# EAGLE design led 4x6 board (EAGLE 9.0.0)
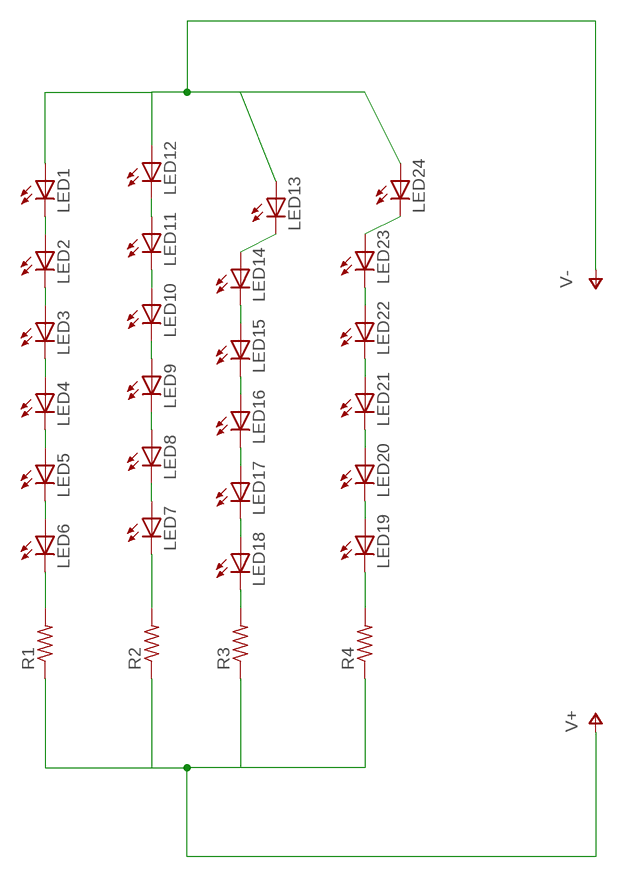
[diagram p0: schematic, sheet 1]

## Parts
LED1  LEDLZR181  [LZR181]
LED2  LEDLZR181  [LZR181]
LED3  LEDLZR181  [LZR181]
LED4  LEDLZR181  [LZR181]
LED5  LEDLZR181  [LZR181]
LED6  LEDLZR181  [LZR181]
LED7  LEDLZR181  [LZR181]
LED8  LEDLZR181  [LZR181]
LED9  LEDLZR181  [LZR181]
LED10  LEDLZR181  [LZR181]
LED11  LEDLZR181  [LZR181]
LED12  LEDLZR181  [LZR181]
LED13  LEDLZR181  [LZR181]
LED14  LEDLZR181  [LZR181]
LED15  LEDLZR181  [LZR181]
LED16  LEDLZR181  [LZR181]
LED17  LEDLZR181  [LZR181]
LED18  LEDLZR181  [LZR181]
LED19  LEDLZR181  [LZR181]
LED20  LEDLZR181  [LZR181]
LED21  LEDLZR181  [LZR181]
LED22  LEDLZR181  [LZR181]
LED23  LEDLZR181  [LZR181]
LED24  LEDLZR181  [LZR181]
R1  R-US_V234/12  [V234/12]
R2  R-US_V234/12  [V234/12]
R3  R-US_V234/12  [V234/12]
R4  R-US_V234/12  [V234/12]

## Nets
N$1: LED9.A LED10.K(C)
N$2: LED22.A LED23.K(C)
N$3: LED13.K(C) LED14.A
N$4: LED14.K(C) LED15.A
N$5: LED15.K(C) LED16.A
N$6: LED16.K(C) LED17.A
N$7: LED17.K(C) LED18.A
N$8: LED1.K(C) LED2.A
N$9: LED2.K(C) LED3.A
N$10: LED3.K(C) LED4.A
N$11: LED4.K(C) LED5.A
N$12: LED8.A LED9.K(C)
N$13: LED7.A LED8.K(C)
N$14: LED11.A LED12.K(C)
N$15: LED5.K(C) LED6.A
N$16: LED6.K(C) R1.2
N$17: LED10.A LED11.K(C)
N$18: LED7.K(C) R2.2
N$19: LED18.K(C) R3.2
N$20: LED23.A LED24.K(C)
N$21: LED21.A LED22.K(C)
N$22: LED20.A LED21.K(C)
N$23: LED19.A LED20.K(C)
N$24: LED19.K(C) R4.2
V+: R1.1 R2.1 R3.1 R4.1
V-: LED1.A LED12.A LED13.A LED24.A

## Library data of the parts
LED1-LED24 = led:LED: LED OSRAM: - CHIPLED LG R971, LG N971, LY N971, LG Q971, LY Q971, LO R971, LY R971 LH N974, LH R974 LS Q976, LO Q976, LY Q976 LO Q996 - Hyper CHIPLED LW Q18S LB Q993, LB Q99A, LB R99A - SideLED LS A670, LO A670, LY A670, LG A670, LP A670 LB A673, LV A673, LT A673, LW A673 LH A674 LY A675 LS A676, LA A676, LO A676, LY A676, LW A676 LS A679, LY A679, LG A679 - Hyper Micro SIDELED® LS Y876, LA Y876, LO Y876, LY Y876 LT Y87S - SmartLED LW L88C, LW L88S LB L89C, LB L89S, LG L890 LS L89K, LO L89K, LY L89K LS L896, LA L896, LO L896, LY L896 - TOPLED LS T670, LO T670, LY T670, LG T670, LP T670 LSG T670, LSP T670, LSY T670, LOP T670, LYG T670 LG T671, LOG T671, LSG T671 LB T673, LV T673, LT T673, LW T673 LH T674 LS T676, LA T676, LO T676, LY T676, LB T676, LH T676, LSB T676, LW T676 LB T67C, LV T67C, LT T67C, LS T67K, LO T67K, LY T67K, LW E67C LS E67B, LA E67B, LO E67B, LY E67B, LB E67C, LV E67C, LT E67C LW T67C LS T679, LY T679, LG T679 LS T770, LO T770, LY T770, LG T770, LP T770 LB T773, LV T773, LT T773, LW T773 LH T774 LS E675, LA E675, LY E675, LS T675 LS T776, LA T776, LO T776, LY T776, LB T776 LHGB T686 LT T68C, LB T68C - Hyper Mini TOPLED® LB M676 - Mini TOPLED Santana® LG M470 LS M47K, LO M47K, LY M47K Source: http://www.osram.convergy.de LUXEON: - LUMILED® LXK2-PW12-R00, LXK2-PW12-S00, LXK2-PW14-U00, LXK2-PW14-V00 LXK2-PM12-R00, LXK2-PM12-S00, LXK2-PM14-U00 LXK2-PE12-Q00, LXK2-PE12-R00, LXK2-PE12-S00, LXK2-PE14-T00, LXK2-PE14-U00 LXK2-PB12-K00, LXK2-PB12-L00, LXK2-PB12-M00, LXK2-PB14-N00, LXK2-PB14-P00, LXK2-PB14-Q00 LXK2-PR12-L00, LXK2-PR12-M00, LXK2-PR14-Q00, LXK2-PR14-R00 LXK2-PD12-Q00, LXK2-PD12-R00, LXK2-PD12-S00 LXK2-PH12-R00, LXK2-PH12-S00 LXK2-PL12-P00, LXK2-PL12-Q00, LXK2-PL12-R00 Source: www.luxeon.com KINGBRIGHT: KA-3528ASYC Source: www.kingbright.com
R1-R4 = resistor:R-US_: RESISTOR, American symbol

## Board
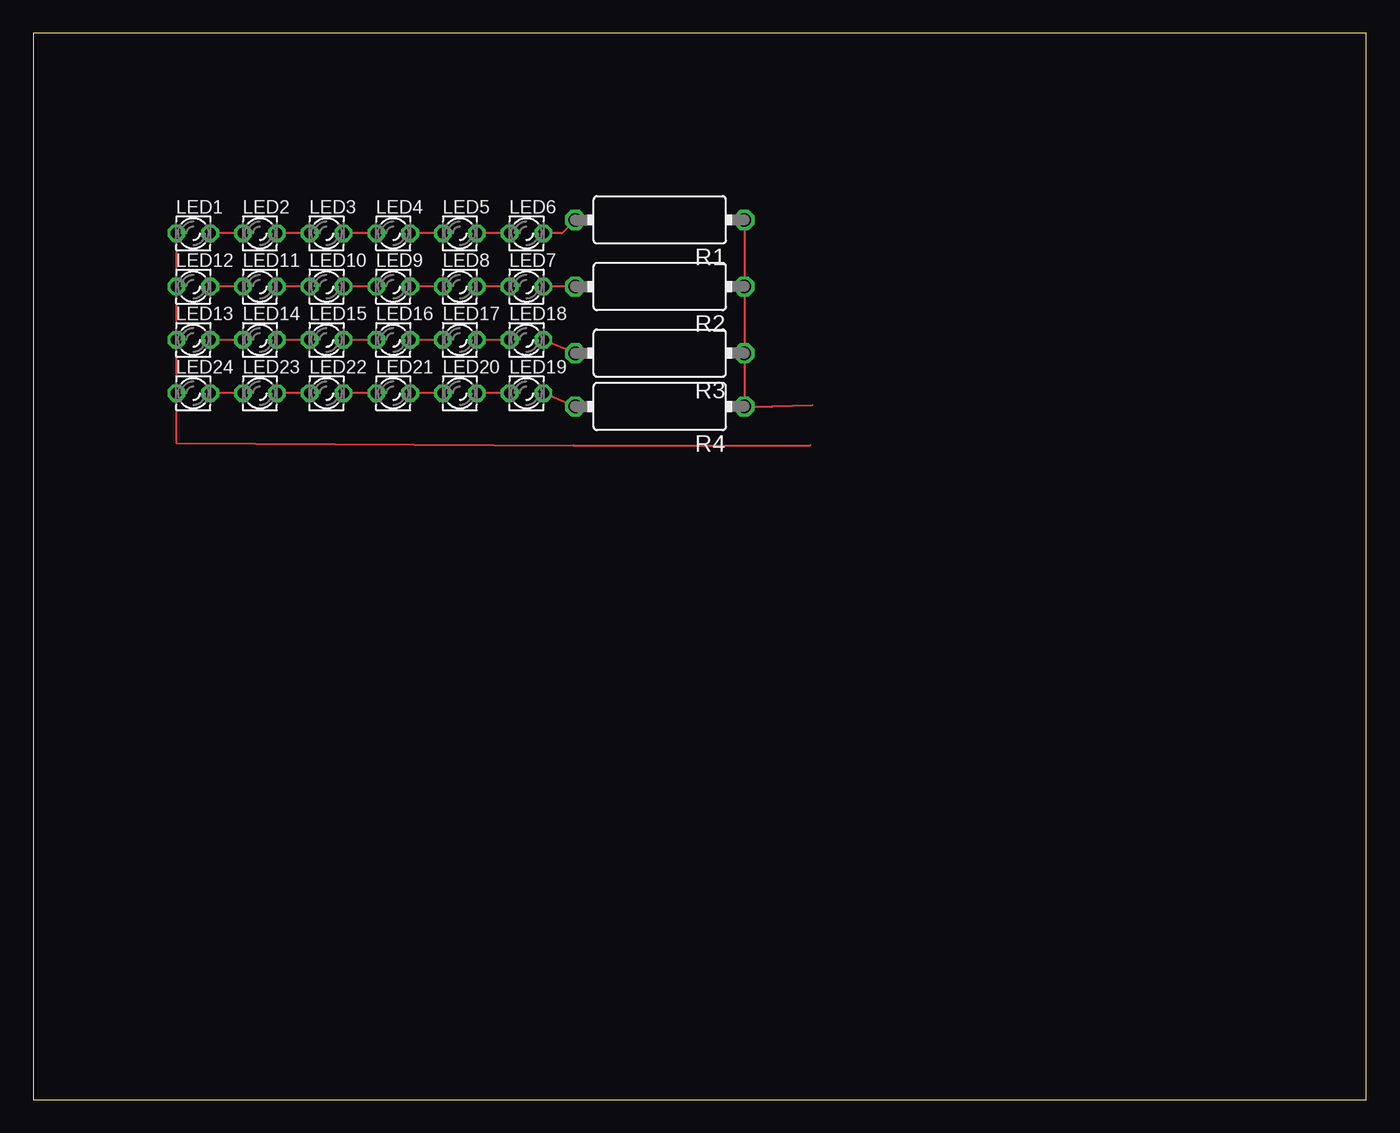
[diagram p1: board, top side]

Size 100 x 80 mm. Coordinates in mm from the lower left corner, seen from the top.
Outline: 0,0 100,0 100,80 0,80 0,0
Copper layers (1*16): Top 0.035mm / dielectric 1.5mm / Bottom 0.035mm
Design rules "default": minimum track width 6mil, minimum drill 0.35mm, track to track 6mil, track to pad 6mil, pad to pad 6mil, via to via 6mil, smd to smd 6mil, copper to edge 40mil, drill to drill 6mil, minimum pad ring 10mil, minimum via ring 8mil, stop-mask expansion 4mil, vias tented up to drill 0mil, thermal gap 10mil

### Footprints (pad centres in the part's own frame; a part is rotated, then mirrored left to right if it is on the bottom)
LZR181 = drill 0.813 octagon: A -1.27,0; K 1.27,0
V234/12 = drill 1.016 octagon: 1 -6.35,0; 2 6.35,0

### Placement (x,y rotation side)
LED1  12,65 0 top
LED2  17,65 0 top
LED3  22,65 0 top
LED4  27,65 0 top
LED5  32,65 0 top
LED6  37,65 0 top
LED7  37,61 0 top
LED8  32,61 0 top
LED9  27,61 0 top
LED10  22,61 0 top
LED11  17,61 0 top
LED12  12,61 0 top
LED13  12,57 0 top
LED14  17,57 0 top
LED15  22,57 0 top
LED16  27,57 0 top
LED17  32,57 0 top
LED18  37,57 0 top
LED19  37,53 0 top
LED20  32,53 0 top
LED21  27,53 0 top
LED22  22,53 0 top
LED23  17,53 0 top
LED24  12,53 0 top
R1  47,66 180 top
R2  47,61 180 top
R3  47,56 180 top
R4  47,52 180 top

### Tracks (layer width: path | path; a pad name or v marks a point on that pad's centre or on a via)
N$1
  Top 0.152: LED9.A LED10.K
N$2
  Top 0.152: LED22.A LED23.K
N$3
  Top 0.152: LED14.A LED13.K
N$4
  Top 0.152: LED15.A LED14.K
N$5
  Top 0.152: LED16.A LED15.K
N$6
  Top 0.152: LED17.A LED16.K
N$7
  Top 0.152: LED18.A LED17.K
N$8
  Top 0.152: LED2.A LED1.K
N$9
  Top 0.152: LED3.A LED2.K
N$10
  Top 0.152: LED4.A LED3.K
N$11
  Top 0.152: LED5.A LED4.K
N$12
  Top 0.152: LED8.A LED9.K
N$13
  Top 0.152: LED7.A LED8.K
N$14
  Top 0.152: LED11.A LED12.K
N$15
  Top 0.152: LED6.A LED5.K
N$16
  Top 0.152: R1.2 39.65,65 LED6.K
N$17
  Top 0.152: LED10.A LED11.K
N$18
  Top 0.152: R2.2 LED7.K
N$19
  Top 0.152: R3.2 LED18.K
N$20
  Top 0.152: LED23.A LED24.K
N$21
  Top 0.152: LED21.A LED22.K
N$22
  Top 0.152: LED20.A LED21.K
N$23
  Top 0.152: LED19.A LED20.K
N$24
  Top 0.152: R4.2 LED19.K
V+
  Top 0.152: 58.44,52.07 55.44,52 R4.1 R3.1 R2.1 R1.1
V-
  Top 0.152: 58.27,49.07 40.54,49.07 10.73,49.26 LED24.A LED13.A LED12.A LED1.A